# Altium schematic sheet sketch.SchDoc
size A
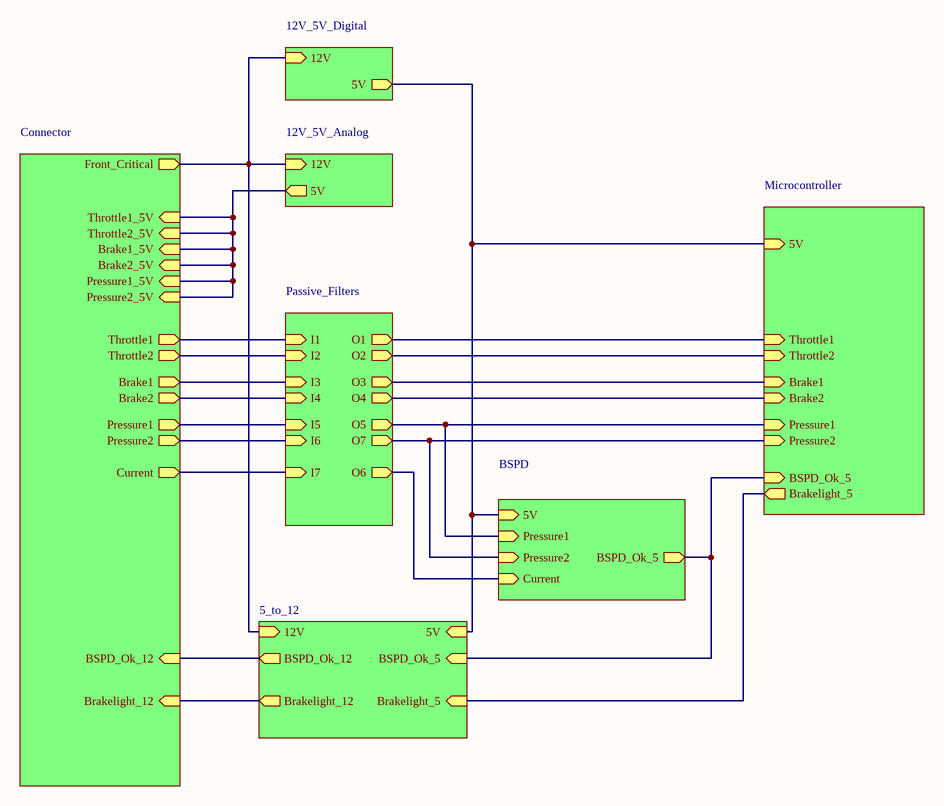
[diagram p0: sketch.SchDoc]

## Sub-sheets
5_to_12 = ?: BSPD_Ok_5 (in), BSPD_Ok_12 (out), Brakelight_5 (in), Brakelight_12 (out), 5V (in), 12V (in)
12V_5V_Analog = ?: 12V (in), 5V (out)
12V_5V_Digital = ?: 12V (in), 5V (out)
BSPD = ?: Current (in), Pressure2 (in), Pressure1 (in), BSPD_Ok_5 (out), 5V (in)
Connector = ?: Throttle1 (out), Front_Critical (out), Throttle1_5V (in), Throttle2_5V (in), Throttle2 (out), Brake1_5V (in), Brake1 (out), Brake2_5V (in), Brake2 (out), Pressure1_5V (in), Pressure1 (out), Pressure2_5V (in), Pressure2 (out), Current (out), BSPD_Ok_12 (in), Brakelight_12 (in)
Microcontroller = ?: 5V (in), Throttle1 (in), Throttle2 (in), Brake1 (in), Brake2 (in), Pressure1 (in), Pressure2 (in), Brakelight_5 (out), BSPD_Ok_5 (in)
Passive_Filters = ?: I1 (in), I2 (in), I3 (in), I4 (in), I5 (in), I6 (in), O1 (out), O2 (out), O3 (out), O4 (out), O5 (out), O7 (out), I7 (in), O6 (out)
? = ?: no entries

## Nets
(unnamed): sheet Connector/Throttle1, sheet Passive_Filters/I1
(unnamed): sheet Connector/Front_Critical, sheet 12V_5V_Analog/12V, sheet 12V_5V_Digital/12V, sheet 5_to_12/12V
(unnamed): sheet Connector/Throttle1_5V, sheet Connector/Throttle2_5V, sheet Connector/Brake1_5V, sheet Connector/Brake2_5V, sheet Connector/Pressure1_5V, sheet Connector/Pressure2_5V, sheet 12V_5V_Analog/5V
(unnamed): sheet Connector/Throttle2, sheet Passive_Filters/I2
(unnamed): sheet Connector/Brake1, sheet Passive_Filters/I3
(unnamed): sheet Connector/Brake2, sheet Passive_Filters/I4
(unnamed): sheet Connector/Pressure1, sheet Passive_Filters/I5
(unnamed): sheet Connector/Pressure2, sheet Passive_Filters/I6
(unnamed): sheet Connector/Current, sheet Passive_Filters/I7
(unnamed): sheet Connector/BSPD_Ok_12, sheet 5_to_12/BSPD_Ok_12
(unnamed): sheet Connector/Brakelight_12, sheet 5_to_12/Brakelight_12
(unnamed): sheet 12V_5V_Digital/5V, sheet BSPD/5V, sheet 5_to_12/5V, sheet Microcontroller/5V
(unnamed): sheet Passive_Filters/O1, sheet Microcontroller/Throttle1
(unnamed): sheet Passive_Filters/O2, sheet Microcontroller/Throttle2
(unnamed): sheet Passive_Filters/O3, sheet Microcontroller/Brake1
(unnamed): sheet Passive_Filters/O4, sheet Microcontroller/Brake2
(unnamed): sheet Passive_Filters/O5, sheet BSPD/Pressure1, sheet Microcontroller/Pressure1
(unnamed): sheet Passive_Filters/O7, sheet BSPD/Pressure2, sheet Microcontroller/Pressure2
(unnamed): sheet Passive_Filters/O6, sheet BSPD/Current
(unnamed): sheet BSPD/BSPD_Ok_5, sheet 5_to_12/BSPD_Ok_5, sheet Microcontroller/BSPD_Ok_5
(unnamed): sheet 5_to_12/Brakelight_5, sheet Microcontroller/Brakelight_5